# Altium schematic sheet BalEv_USB_v1_0.SchDoc
size A4; CompanyName: HESSO; Address1: Route du Rawyl 47; Address2: 1950 Sion; Address3: Switzerland; DocumentNumber: 6; SheetNumber: 3; SheetTotal: 8; PageSetup: Record=PageOptions|CenterHorizontal=True|CenterVertical=True|PrintScale=1.00|XCorrection=1.00|YCorrection=1.00|PrintKind=1|BorderSize=5000000|LeftOffset=0|BottomOffset=0|Orientation=2|PaperLength=1000|PaperWidth=1000|Scale=100|PaperSource=15|PrintQuality=1200|MediaType=1|DitherType=10|PrintScaleMode=1|PaperKind=A4|PaperIndex=9; ProjectName: Project Name
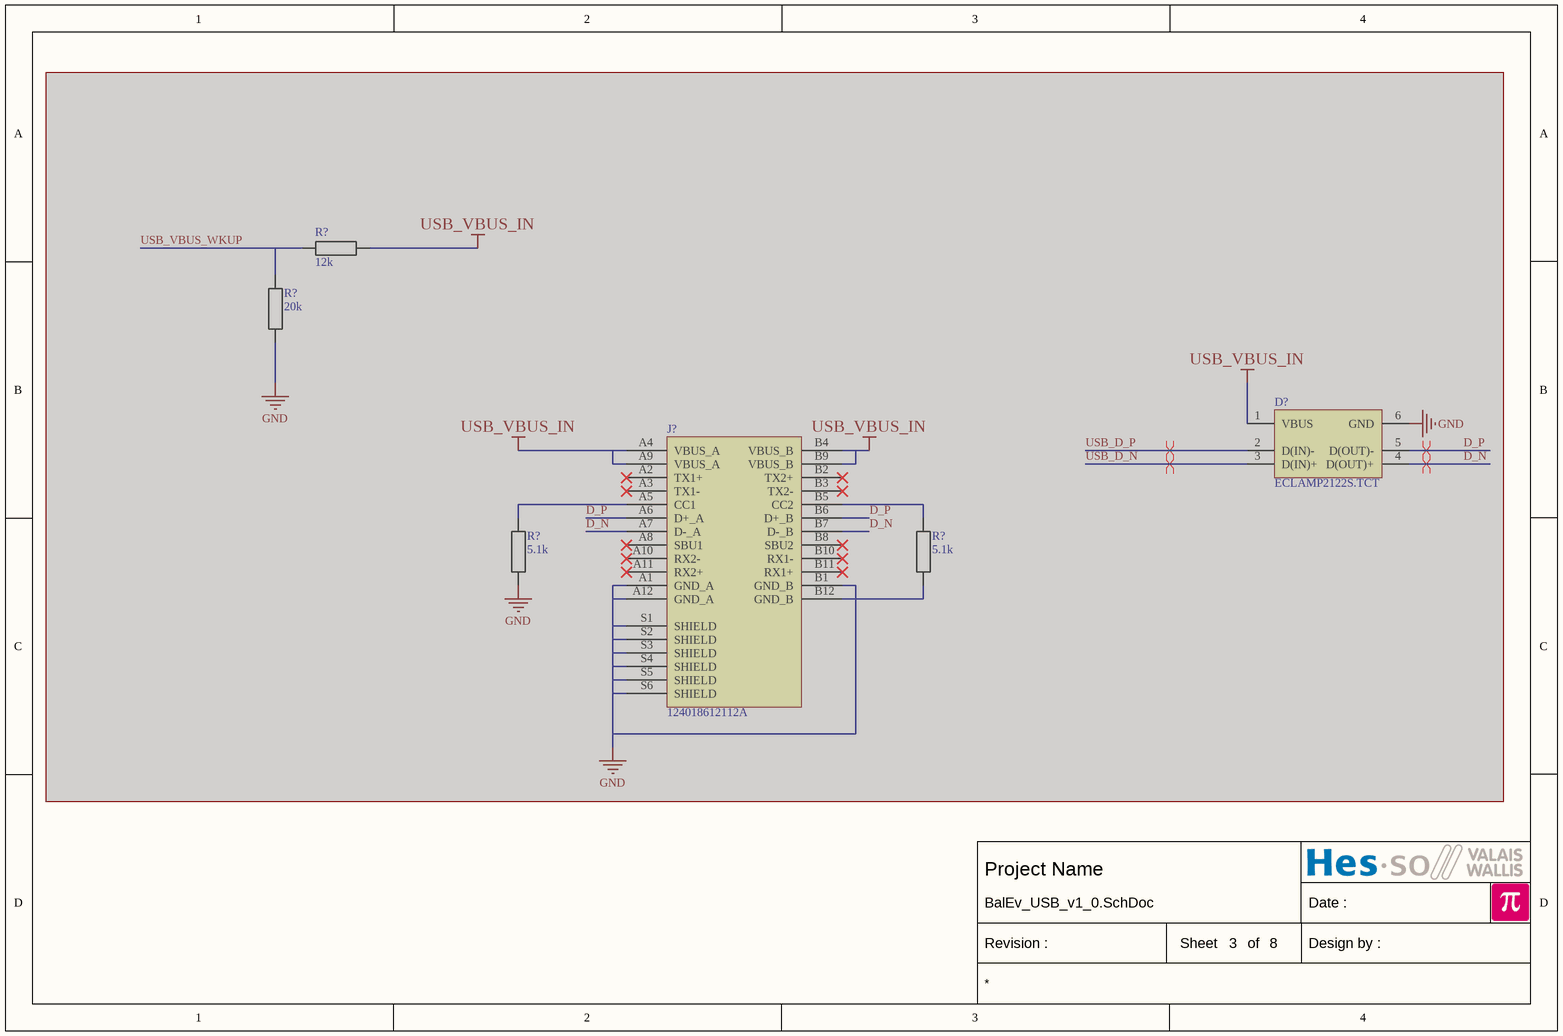
[diagram p0: BalEv_USB_v1_0.SchDoc]

## Parts
(Parts that share a designator on the sheet are numbered #1, #2 ... from top to bottom, then left to right.)
D?  ECLAMP2122S.TCT  [SOT23-6 P0.95 C1.5x3.0 H1.3]  (masked out: inside a compile mask, not in the netlist)
J?  124018612112A  [USB-C SMD AMPHENOL 124018612112A]  (masked out: inside a compile mask, not in the netlist)
R?#1  12k  [RESISTOR 1005 REFLOW]  (masked out: inside a compile mask, not in the netlist)
R?#2  20k  [RESISTOR 1005 REFLOW]  (masked out: inside a compile mask, not in the netlist)
R?#3  5.1k  [RESISTOR 1005 REFLOW]  (masked out: inside a compile mask, not in the netlist)
R?#4  5.1k  [RESISTOR 1005 REFLOW]  (masked out: inside a compile mask, not in the netlist)

## Layout directives
differential pair: (no net found under the mark)

## Notes on the sheet
- Date :
- Revision :
- Sheet
- of
- Design by :

## Library data of the parts
D? = Diode ARRAY ON Semi STF202-22T1G: USB Filter with ESD Protection; Value: ECLAMP2122S.TCT; STOCK: YES
J? = USB-C SMD AMPHENOL 124018612112A: USB-C, USB 3.2 Gen 2 (USB 3.1 Gen 2, Superspeed + (USB 3.1)) Receptacle Connector 24 Position Surface Mount, Right Angle; Through Hole; Value: 124018612112A
R?#1-R?#4 = Resistor
  R?#1: Value: 12k; STOCK: NO
  R?#2: Value: 20k; STOCK: NO
  R?#3 R?#4: Value: 5.1k